# EAGLE design cv05dobes (EAGLE 7.7.0)
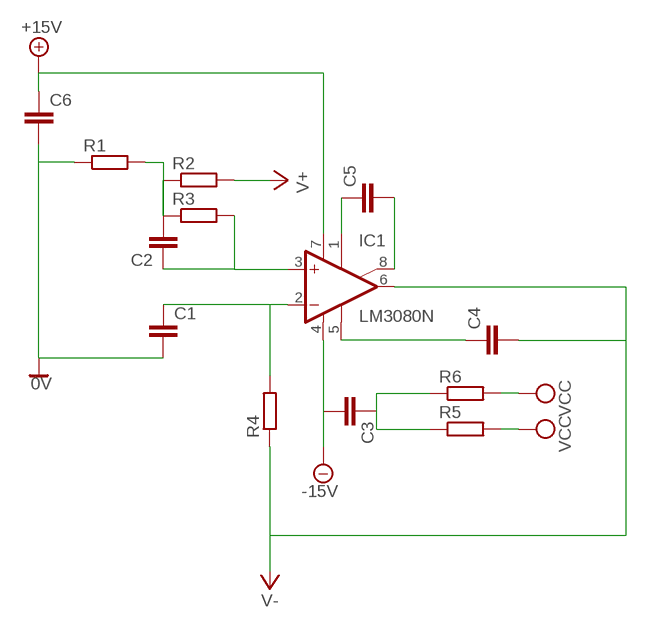
[diagram p0: schematic, sheet 1]

## Parts
C1  C-EU075-042X103  [C075-042X103]
C2  C-EU075-042X103  [C075-042X103]
C3  C-EU075-052X106  [C075-052X106]
C4  C-EU075-052X106  [C075-052X106]
C5  C-EU050-030X075  [C050-030X075]
C6  C-EU050-030X075  [C050-030X075]
IC1  LM3080N  [DIL08]
R1  R-EU_0613/15  [P0613/15]
R2  R-EU_0613/15  [P0613/15]
R3  R-EU_0613/15  [P0613/15]
R4  R-EU_0613/15  [P0613/15]
R5  R-EU_0414/15  [0414/15]
R6  R-EU_0414/15  [0414/15]

## Nets
0V: C1.2 C6.2 R1.1
+15V: C6.1 IC1.7(V+)
-15V: C3.2 IC1.4(V-)
N$1: C5.2 IC1.8(ON2)
N$2: C5.1 IC1.1(ON1)
N$3: C1.1 IC1.2(-IN) R4.2
N$4: C2.1 IC1.3(+IN) R3.2
N$5: C2.2 R1.2 R2.1 R3.1
N$6: R5.1 R6.1
N$7: C4.1 IC1.5(OPT)
V+: R2.2
V-: C4.2 IC1.6(OUT) R4.1
VCC: R5.2 R6.2
Unconnected: C3.1

## Library data of the parts
C1-C6 = resistor:C-EU: CAPACITOR, European symbol
IC1 = linear:*3080: OP AMP
R1-R6 = resistor:R-EU_: RESISTOR, European symbol

## Board
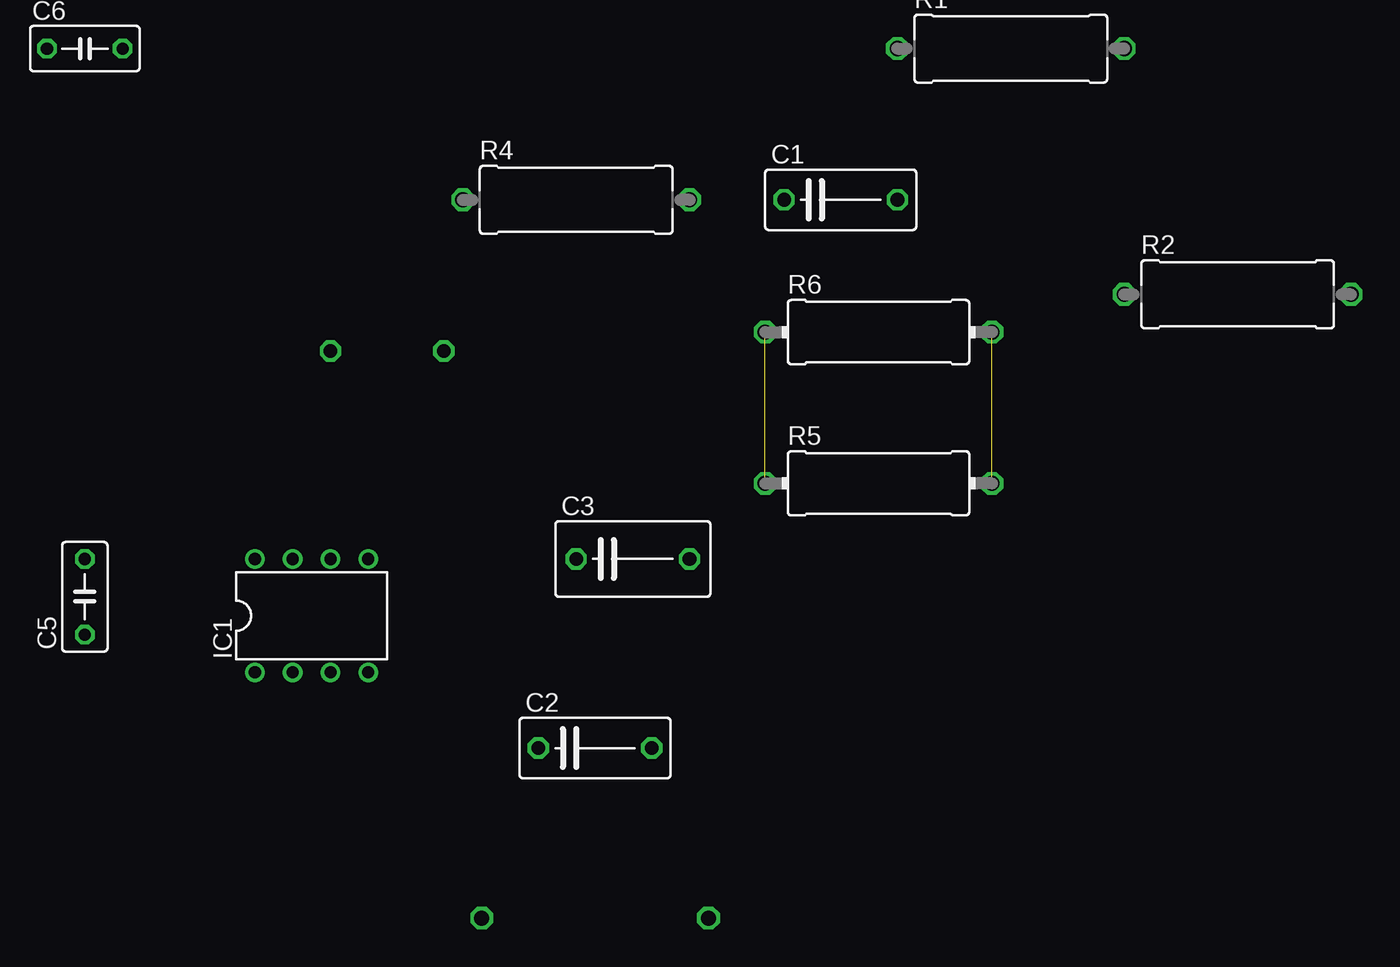
[diagram p1: board, top side]
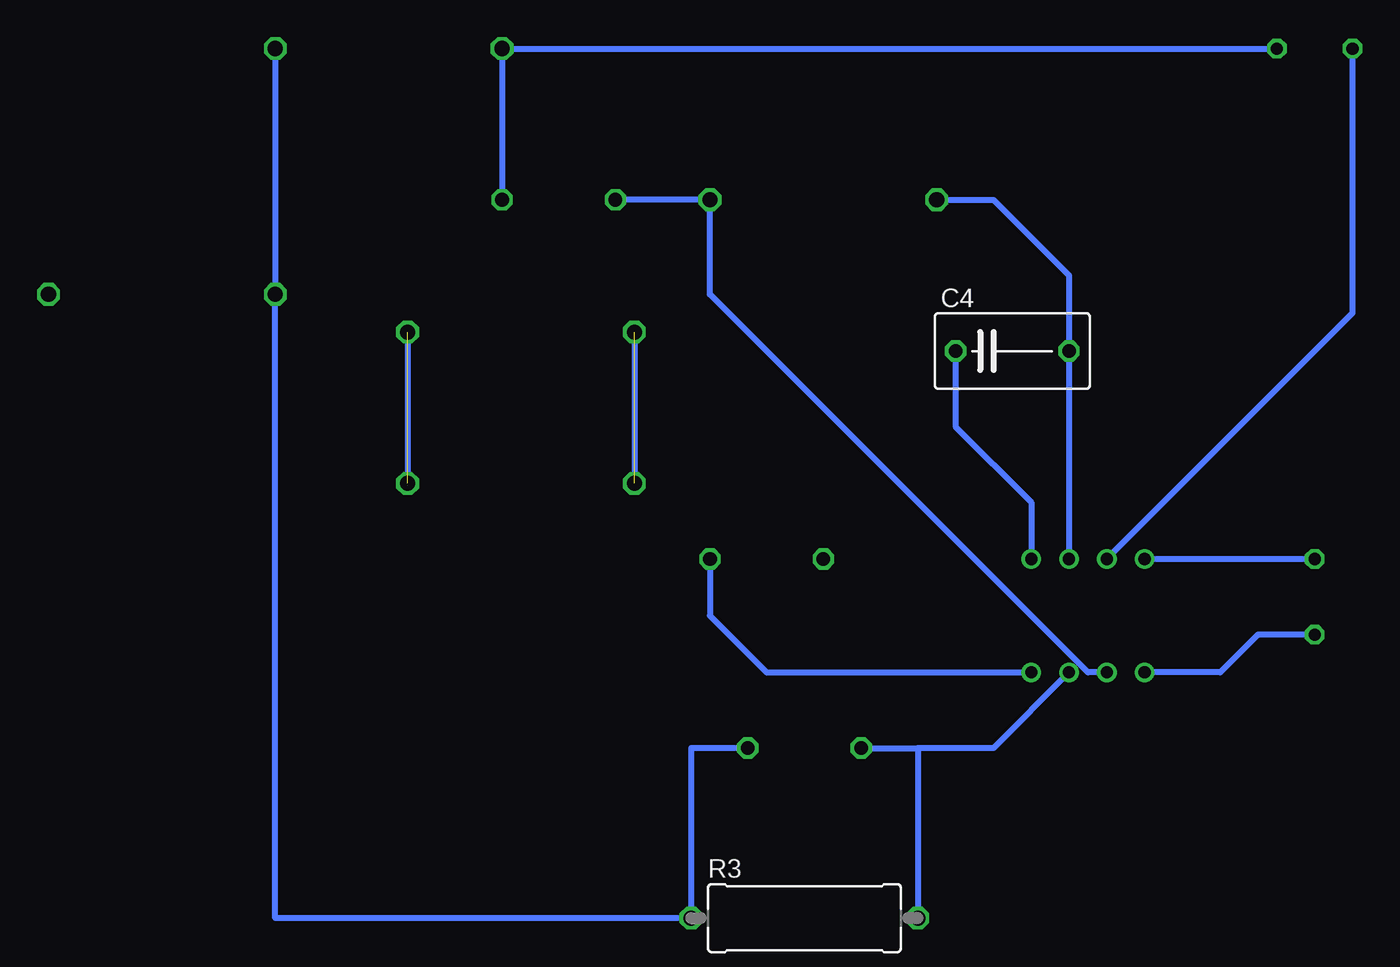
[diagram p2: board, bottom side, seen from below]

No outline drawn. Coordinates in mm, seen from the top.
Copper layers (1*16): Top 0.035mm / dielectric 1.5mm / Bottom 0.035mm
Design rules "default": minimum track width 10mil, minimum drill 24mil, track to track 8mil, track to pad 8mil, pad to pad 8mil, via to via 8mil, smd to smd 8mil, copper to edge 40mil, drill to drill 8mil, minimum pad ring 10mil, minimum via ring 8mil, stop-mask expansion 4mil, vias tented up to drill 0mil, thermal gap 10mil

### Footprints (pad centres in the part's own frame; a part is rotated, then mirrored left to right if it is on the bottom)
C075-042X103 = drill 0.914 octagon: 1 -3.81,0; 2 3.81,0
C075-052X106 = drill 0.914 octagon: 1 -3.81,0; 2 3.81,0
C050-030X075 = drill 0.813 octagon: 1 -2.54,0; 2 2.54,0
DIL08 = drill 0.813 pad 1.27: 1 -3.81,-3.81; 2 -1.27,-3.81; 3 1.27,-3.81; 4 3.81,-3.81; 5 3.81,3.81; 6 1.27,3.81; 7 -1.27,3.81; 8 -3.81,3.81
P0613/15 = drill 1.016 octagon: 1 -7.62,0; 2 7.62,0
0414/15 = drill 1.016 octagon: 1 -7.62,0; 2 7.62,0

### Placement (x,y rotation side)
C1  66.04,64.77 0 top
C2  49.53,27.94 0 top
C3  52.07,40.64 0 top
C4  35.56,54.61 0 bottom
C5  15.24,38.1 90 top
C6  15.24,74.93 0 top
IC1  30.48,36.83 0 top
R1  77.47,74.93 0 top
R2  92.71,58.42 0 top
R3  49.53,16.51 0 bottom
R4  48.26,64.77 0 top
R5  68.58,45.72 0 top
R6  68.58,55.88 0 top

### Tracks (layer width: path | path; a pad name or v marks a point on that pad's centre or on a via)
0V
  Bottom 0.406: C1.2 R1.1 C6.2
+15V
  Bottom 0.406: C6.1 12.7,57.15 IC1.7
-15V
  Bottom 0.406: C3.2 55.88,36.83 52.07,33.02 IC1.4
N$1
  Bottom 0.406: IC1.8 C5.2
N$2
  Bottom 0.406: C5.1 19.05,35.56 21.59,33.02 IC1.1
N$3
  Bottom 0.406: C1.1 R4.2 55.88,58.42 30.48,33.02 IC1.2
N$4
  Bottom 0.406: IC1.3 36.83,27.94 41.91,27.94 | C2.1 41.91,27.94 | 41.91,27.94 R3.2
N$5
  Bottom 0.406: R1.2 R2.1 85.09,16.51 R3.1 57.15,27.94 C2.2
N$6  (1 unrouted)
  Bottom 0.406: R6.1 R5.1
N$7
  Bottom 0.406: C4.1 39.37,49.53 34.29,44.45 IC1.5
V-
  Bottom 0.406: R4.1 36.83,64.77 31.75,59.69 C4.2 IC1.6
VCC  (1 unrouted)
  Bottom 0.406: R6.2 R5.2